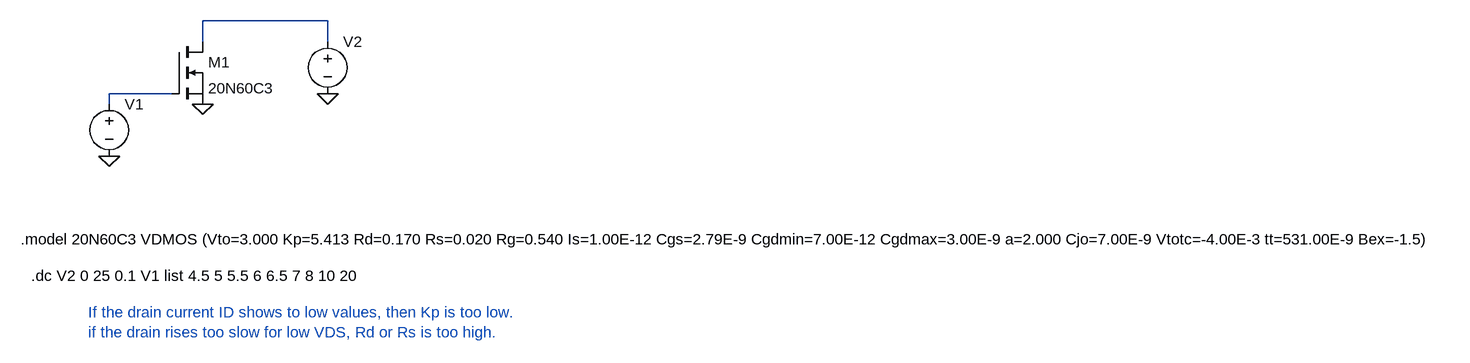
[diagram p0: schematic vdmos_output_characteristic2.asc]
vdmos_output_characteristic2.asc, the LTspice schematic file:
Version 4
SHEET 1 2164 680
WIRE 256 48 64 48
WIRE 64 80 64 48
WIRE 256 80 256 48
WIRE 16 160 -80 160
WIRE -80 176 -80 160
FLAG -80 256 0
FLAG 64 176 0
FLAG 256 160 0
SYMBOL nmos 16 80 R0
SYMATTR InstName M1
SYMATTR Value 20N60C3
SYMBOL voltage -80 160 R0
WINDOW 3 24 96 Invisible 2
WINDOW 123 0 0 Left 0
WINDOW 39 0 0 Left 0
SYMATTR InstName V1
SYMATTR Value 0
SYMBOL voltage 256 64 R0
WINDOW 3 24 96 Invisible 2
WINDOW 123 0 0 Left 0
WINDOW 39 0 0 Left 0
SYMATTR InstName V2
SYMATTR Value 0
TEXT -216 384 Left 2 !.model 20N60C3 VDMOS (Vto=3.000 Kp=5.413 Rd=0.170 Rs=0.020 Rg=0.540 Is=1.00E-12 Cgs=2.79E-9 Cgdmin=7.00E-12 Cgdmax=3.00E-9 a=2.000 Cjo=7.00E-9 Vtotc=-4.00E-3 tt=531.00E-9 Bex=-1.5)
TEXT -200 440 Left 2 !.dc V2 0 25 0.1 V1 list 4.5 5 5.5 6 6.5 7 8 10 20
TEXT -112 496 Left 2 ;If the drain current ID shows to low values, then Kp is too low.\nif the drain rises too slow for low VDS, Rd or Rs is too high.

The netlist it stands for:
* vdmos_output_characteristic2.asc
M1 N001 N002 0 0 20N60C3
V1 N002 0 0
V2 N001 0 0
.model NMOS NMOS
.model PMOS PMOS
.lib standard.mos
.model 20N60C3 VDMOS (Vto=3.000 Kp=5.413 Rd=0.170 Rs=0.020 Rg=0.540 Is=1.00E-12 Cgs=2.79E-9 Cgdmin=7.00E-12 Cgdmax=3.00E-9 a=2.000 Cjo=7.00E-9 Vtotc=-4.00E-3 tt=531.00E-9 Bex=-1.5)
.dc V2 0 25 0.1 V1 list 4.5 5 5.5 6 6.5 7 8 10 20
* If the drain current ID shows to low values, then Kp is too low.
* if the drain rises too slow for low VDS, Rd or Rs is too high.
.backanno
.end